# Altium project SamplingDevice.PrjPcb
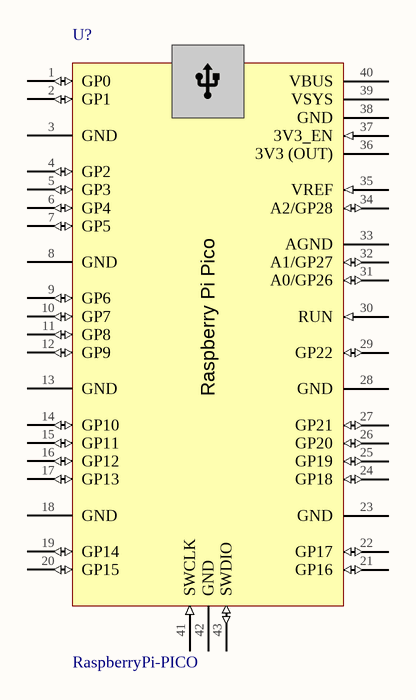
[diagram p0: Sampler_Schematic.SchDoc]
1 sheet, 1 parts. Net scope: global (net labels, ports and power ports of the same name join across sheets).
Board file: Sampler_PCB.PcbDoc

## Sheet Sampler_Schematic.SchDoc
size A0; SheetNumber: 1; SheetTotal: 1

### Parts
U?  RaspberryPi-PICO  [RaspberryPiPico]

### Nets

Not connected (* = marked no-connect by the designer): U? 1(GP0) 2(GP1) 3(GND) 4(GP2) 5(GP3) 6(GP4) 7(GP5) 8(GND) 9(GP6) 10(GP7) 11(GP8) 12(GP9) 13(GND) 14(GP10) 15(GP11) 16(GP12) 17(GP13) 18(GND) 19(GP14) 20(GP15) 21(GP16) 22(GP17) 23(GND) 24(GP18) 25(GP19) 26(GP20) 27(GP21) 28(GND) 29(GP22) 30(RUN) 31(A0/GP26) 32(A1/GP27) 33(AGND) 34(A2/GP28) 35(VREF) 36(3V3_(OUT)) 37(3V3_EN) 38(GND) 39(VSYS) 40(VBUS) 41(SWCLK) 42(GND) 43(SWDIO)

### Notes on the sheet
- (in symbol RaspberryPi-PICO) Raspberry Pi Pico

### Library data of the parts
U? = RaspberryPi-PICO: Compute Module; 512Mb RAM; 4GB Flash; 67.6x30mm; BCM2835; Fits into DDR2 SODIMM; Manufacturer Part Number: RASPBERRY PI COMPUTE BOARD; Evaluation Kit: Yes; Core Architecture: ARM; Supplier 1: Digi-Key; Manufacturer: Raspberry Pi; RoHS: Yes; Category: Single Board Computers (SBCs); Case/Package: Module; ComponentLink1URL: https://media.digikey.com/pdf/Data%20Sheets/Raspberry%20Pi%20PDFs/Compute_Module_Web.pdf?src-supplier=Digi-Key; ComponentLink1Description: https://media.digikey.com/pdf/Data%20Sheets/Raspberry%20Pi%20PDFs/Compute_Module_Web.pdf?src-supplier=Digi-Key; Supplier Part Number 1: 1690-1003-ND